# Altium schematic sheet USB_Hub.SchDoc (part 3 of 3)
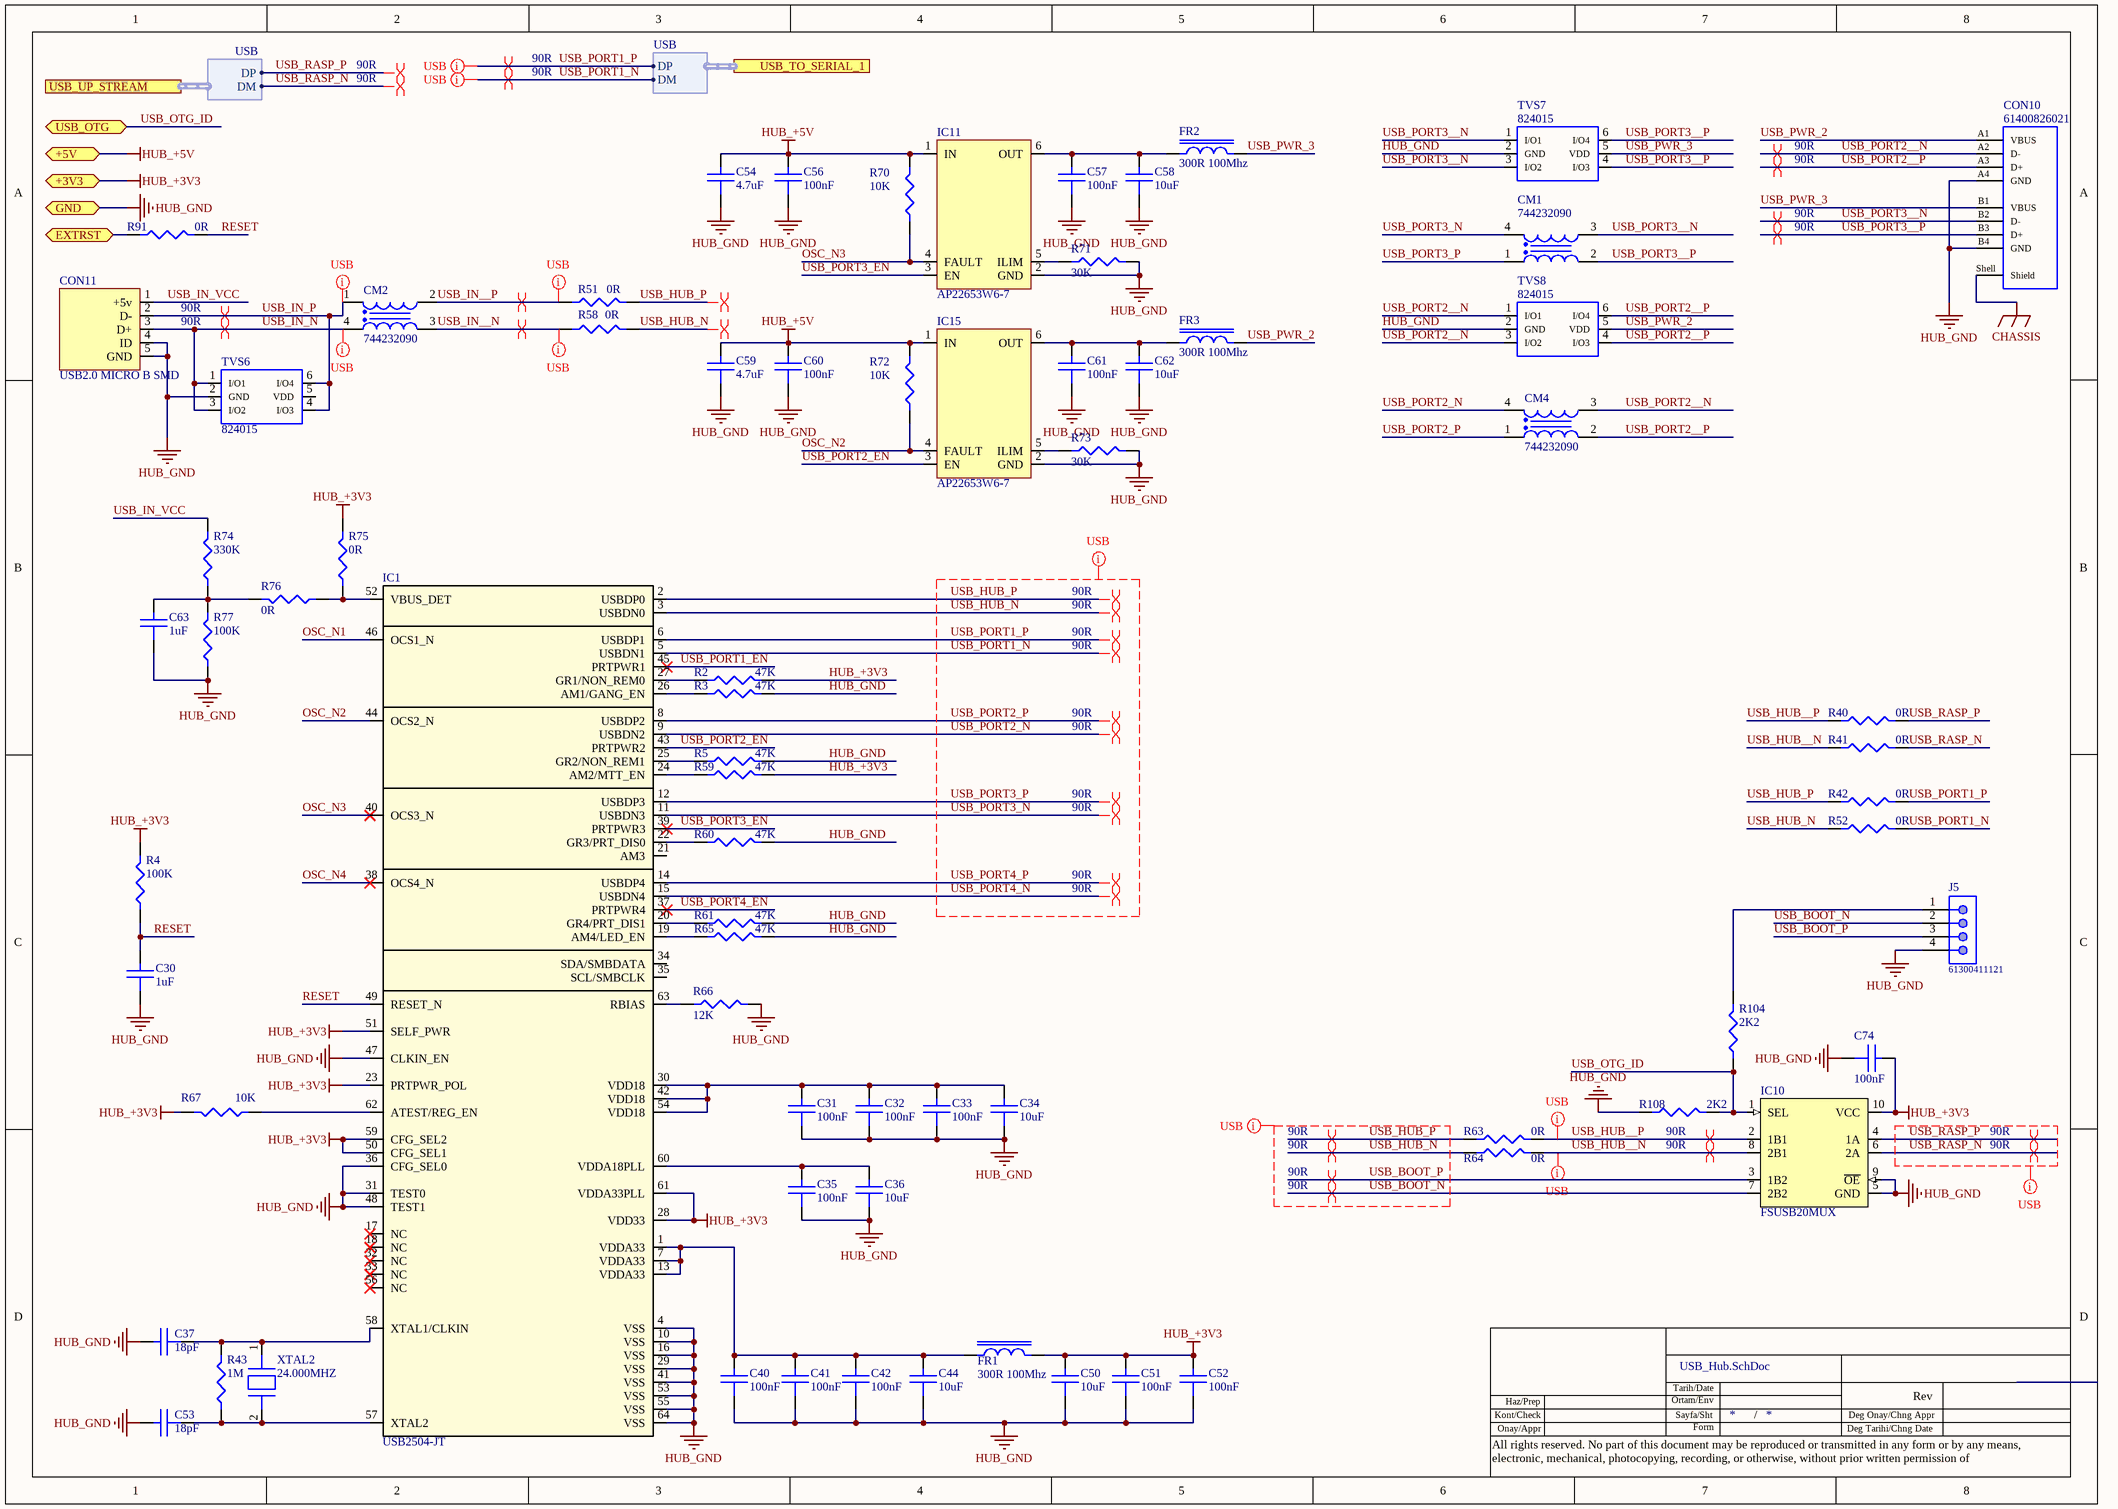
[diagram p2: USB_Hub.SchDoc]

## Library data of the parts (continued)
XTAL2 = ABLS-24.000MHZ-B2-T: CRYSTAL 24.0000MHZ 18PF SMD; Manufacturer: Abracon; Frequency: 24MHz; Frequency Tolerance: 20ppm; ESR (Equivalent Series Resistance): 40R; Frequency Stability: 50ppm; Supplier 1: Digi-Key; Manufacturer Part Number: ABLS-24.000MHZ-B2-T; Stock 1: 10538; Pricing 1: 1 = 0,50000, 10 = 0,41300, 50 = 0,37120, 100 = 0,33000, 500 = 0,31350 (USD); RoHS: Yes; Mount: Surface Mount; Case/Package: SMD/SMT; Number of Pins: 2; Contact Plating: Tin; Min Operating Temperature: -20°C; Max Operating Temperature: 70°C; Package Quantity: 1000; Load Capacitance: 18pF; Packaging: Tape and Reel; Tolerance: 20ppm; Termination: SMD/SMT; Series Resistance: 40R; Length: 11.4mm; Height: 0.165inch; Width: 0.185inch; Depth: 4.7mm; Radiation Hardening: No; REACH SVHC: No SVHC; Lead Free: Lead Free; ComponentLink1URL: https://datasheet.ciiva.com/26927/getdatasheetpartid-771243-26927969.pdf?src-supplier=Verical; ComponentLink1Description: https://datasheet.ciiva.com/26927/getdatasheetpartid-771243-26927969.pdf?src-supplier=Verical; ComponentLink2URL: https://datasheet.ciiva.com/15116/getdatasheetpartid-719917-15116794.pdf?src-supplier=Verical; ComponentLink2Description: https://datasheet.ciiva.com/15116/getdatasheetpartid-719917-15116794.pdf?src-supplier=Verical; ComponentLink3URL: https://datasheet.ciiva.com/854/abls-854291.pdf?src-supplier=Digi-Key; ComponentLink3Description: https://datasheet.ciiva.com/854/abls-854291.pdf?src-supplier=Digi-Key; ComponentLink4URL: https://datasheet.ciiva.com/854/abls-854292.pdf?src-supplier=Digi-Key; ComponentLink4Description: https://datasheet.ciiva.com/854/abls-854292.pdf?src-supplier=Digi-Key; ComponentLink5URL: https://datasheet.ciiva.com/854/abls-854293.pdf?src-supplier=Digi-Key; ComponentLink5Description: https://datasheet.ciiva.com/854/abls-854293.pdf?src-supplier=Digi-Key; ComponentLink6URL: https://datasheet.ciiva.com/3175/abls-3175381.pdf?src-supplier=Avnet; ComponentLink6Description: https://datasheet.ciiva.com/3175/abls-3175381.pdf?src-supplier=Avnet; ComponentLink7URL: https://datasheet.ciiva.com/7998/abls-7998426.pdf?src-supplier=Element14; ComponentLink7Description: https://datasheet.ciiva.com/7998/abls-7998426.pdf?src-supplier=Element14; ComponentLink8URL: https://datasheet.ciiva.com/16296/abls-16296138.pdf?src-supplier=Future+Electronics; ComponentLink8Description: https://datasheet.ciiva.com/16296/abls-16296138.pdf?src-supplier=Future+Electronics; Supplier Part Number 1: 535-9076-1-ND; Category: Crystals